# EAGLE design Simple-Charger-LiIon-OpampBased-LM324-Rev (EAGLE 7.2.0)
Simple LM358 OP-AMP based USB Li-ion charger https://www.circuitsdiy.com/simple-lm358-op-amp-based-usb-li-ion-charger/ https://www.circuitsdiy.com/usb-li-ion-charger-revision/
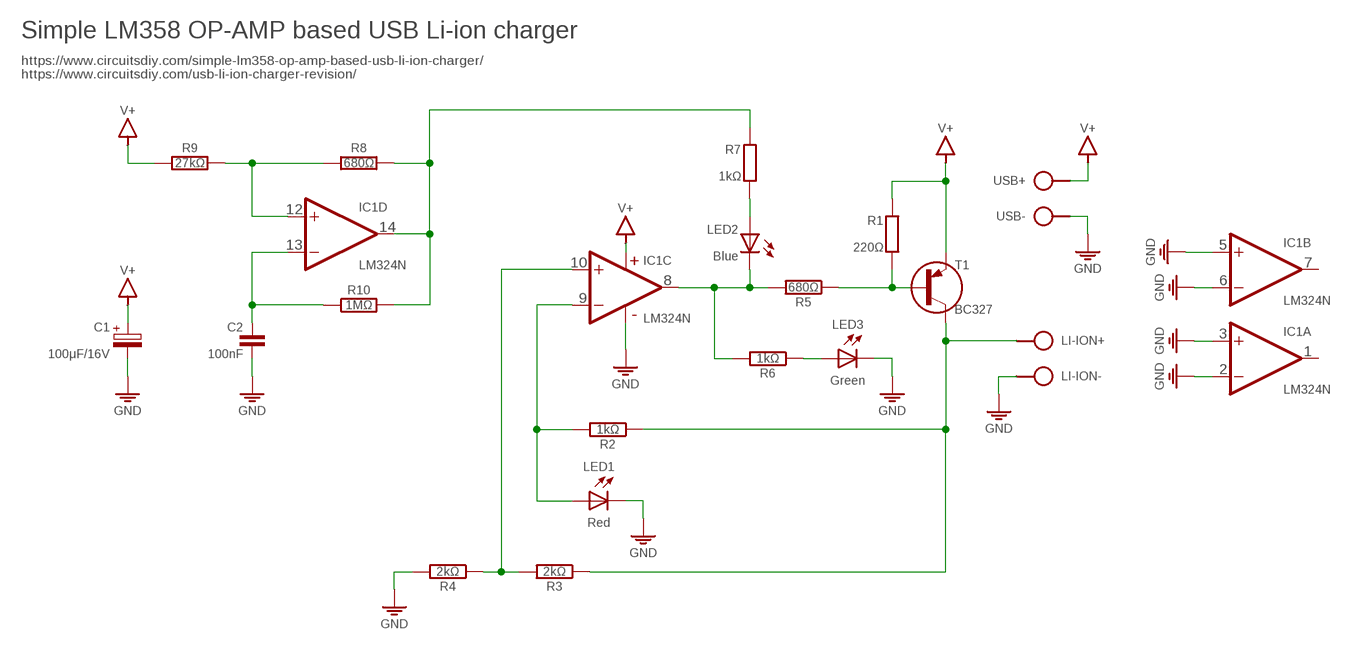
[diagram p0: schematic, sheet 1]

## Parts
C1  100μF/16V  CPOLE2.5-5  [E2,5-5]
C2  100nF  C050-020X044/V  [C050-020X044/V]
IC1  LM324N  [DIL14]
LED1  Red  LED-H-3MM  [LED_3MM]
LED2  Blue  LED-3MM  [LED_3MM]
LED3  Green  LED-H-3MM  [LED_3MM]
LI-ION  SPAD+-+-  [SPAD+-]
R1  220Ω  R0204/10-V  [0204/10-V]
R2  1kΩ  R-H0204/10  [0204/10]
R3  2kΩ  R-H0204/10  [0204/10]
R4  2kΩ  R-H0204/12-V  [0204/12-V]
R5  680Ω  R-H0204/10  [0204/10]
R6  1kΩ  R-H0204/10  [0204/10]
R7  1kΩ  R0204/10  [0204/10]
R8  680Ω  R-H0204/10  [0204/10]
R9  27kΩ  R-H0204/10  [0204/10]
R10  1MΩ  R-H0204/2.54  [0204/2.54]
T1  BC327  [TO92]
USB  SPAD+--+  [SPAD-+]

## Nets
GND: C1.- C2.2 IC1.2(A:-IN) IC1.3(A:+IN) IC1.5(B:+IN) IC1.6(B:-IN) IC1.11(P:V-) LED1.K LED3.K LI-ION.1 R4.2 USB.1
N$1: IC1.12(D:+IN) R8.2 R9.2
N$2: LED2.A R7.2
N$3: C2.1 IC1.13(D:-IN) R10.1
N$4: IC1.14(D:OUT) R7.1 R8.1 R10.2
N$5: IC1.9(C:-IN) LED1.A R2.2
N$7: IC1.8(C:OUT) LED2.K R5.2 R6.2
N$8: R1.2 R5.1 T1.2(B)
N$10: LI-ION.2 R2.1 R3.1 T1.1(C)
N$11: LED3.A R6.1
N$13: IC1.10(C:+IN) R3.2 R4.1
V+: C1.+ IC1.4(P:V+) R1.1 R9.1 T1.3(E) USB.2
Unconnected: IC1.1(A:OUT) IC1.7(B:OUT)

## Notes on the sheet
- Simple LM358 OP-AMP based USB Li-ion charger
- https://www.circuitsdiy.com/simple-lm358-op-amp-based-usb-li-ion-charger/
  https://www.circuitsdiy.com/usb-li-ion-charger-revision/

## Library data of the parts
C1 = c:CPOL: POLARIZED CAPACITOR, European symbol
C2 = c:C: CAPACITOR, European symbol
IC1 = ic:LM324: Single Supply Quad Operational Amplifiers http://www.ti.com/lit/ds/symlink/lm324.pdf
LED1 LED3 = d:LED-H
LED2 = d:LED
LI-ION USB = pad:SPAD+-
R1 R7 = r:R: RESISTOR, European symbol
R2-R6 R8-R10 = r:R-H
T1 = t:BC327

## Board
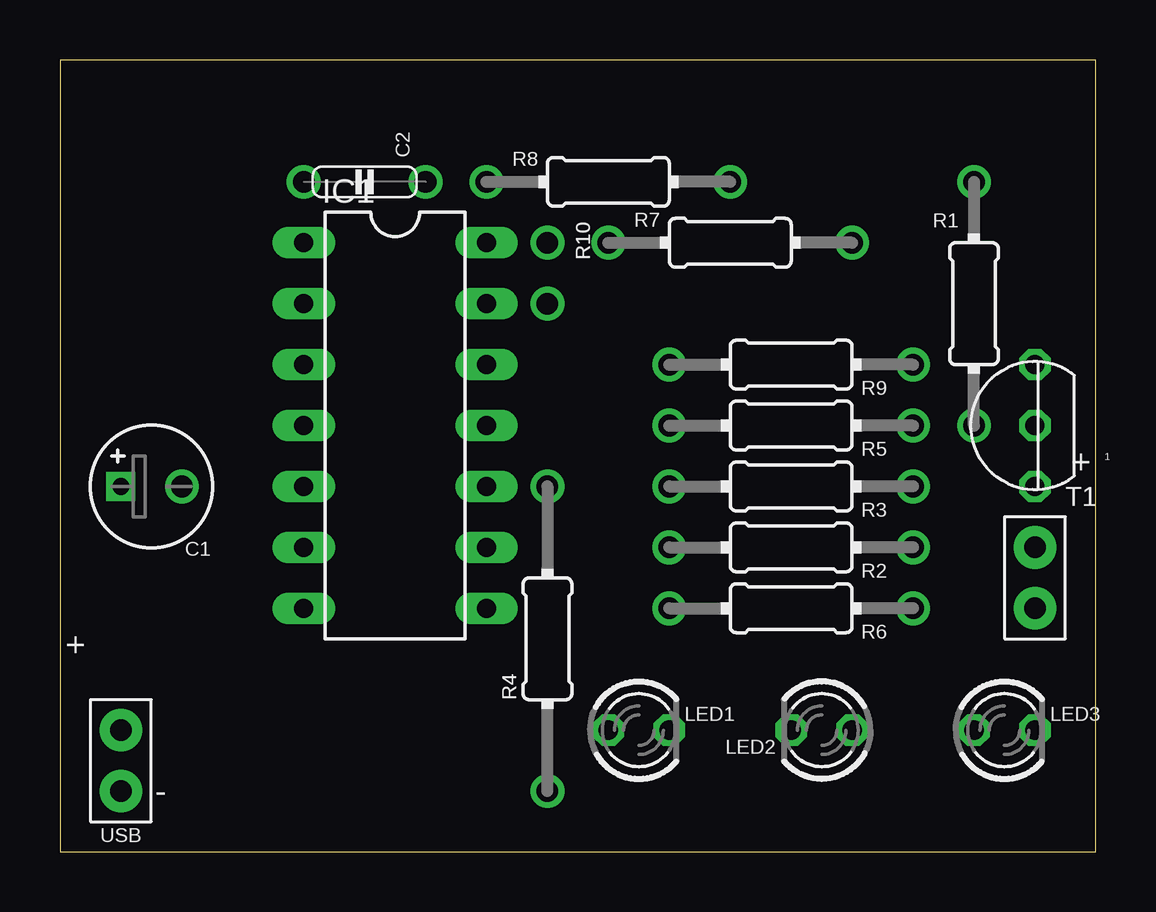
[diagram p1: board, top side]
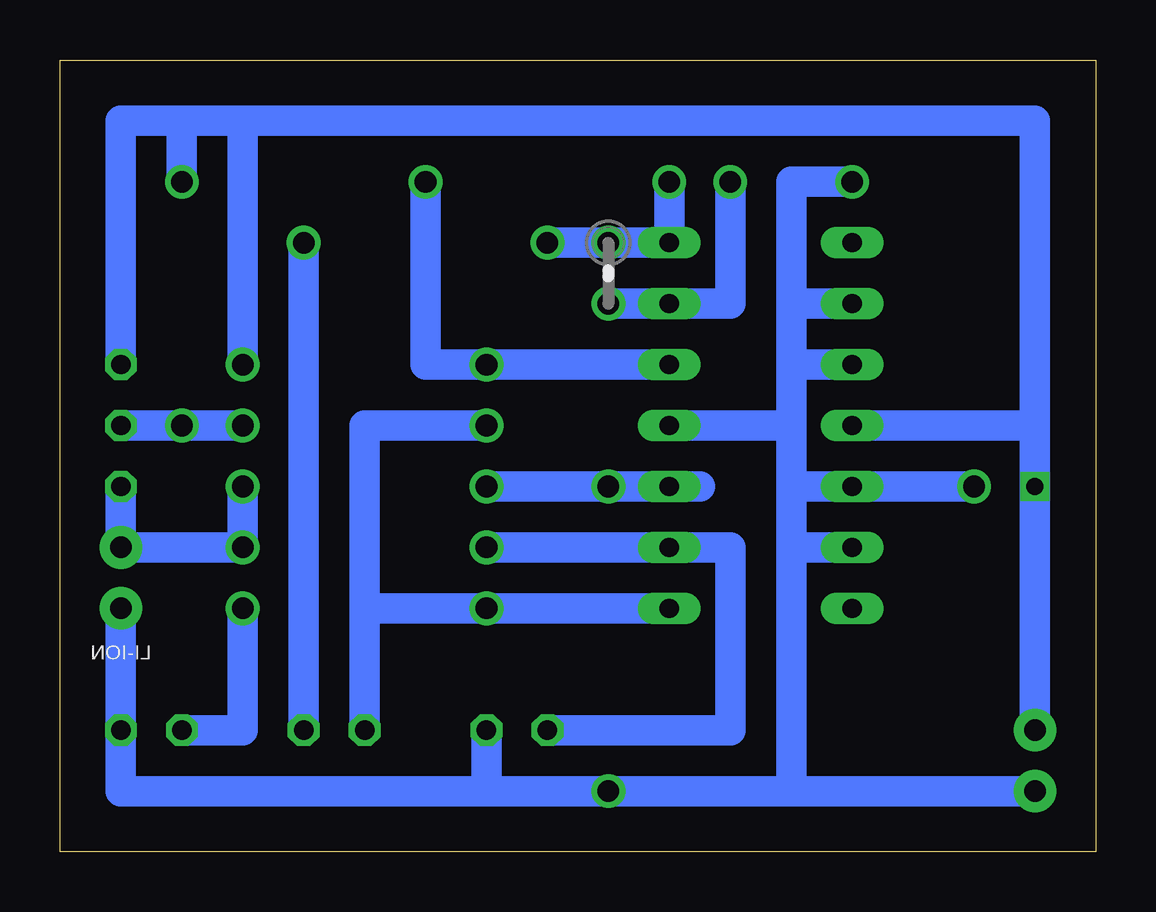
[diagram p2: board, bottom side, seen from below]

Size 43.18 x 33.02 mm. Coordinates in mm from the lower left corner, seen from the top.
Outline: 0,0 43.18,0 43.18,33.02 0,33.02 0,0
Copper layers (1*16): Top 0.035mm / dielectric 1.5mm / Bottom 0.035mm
Design rules "default": minimum track width 10mil, minimum drill 24mil, track to track 8mil, track to pad 8mil, pad to pad 8mil, via to via 8mil, smd to smd 8mil, copper to edge 40mil, drill to drill 8mil, minimum pad ring 10mil, minimum via ring 8mil, stop-mask expansion 4mil, vias tented up to drill 0mil, thermal gap 10mil

### Footprints (pad centres in the part's own frame; a part is rotated, then mirrored left to right if it is on the bottom)
E2,5-5 = drill 0.7 square: + 1.27,0 | drill 0.9: - -1.27,0
C050-020X044/V = drill 0.9: 1 0,2.54; 2 0,-2.54
DIL14 = drill 0.8 long: 1 -3.81,7.62; 2 -3.81,5.08; 3 -3.81,2.54; 4 -3.81,0; 5 -3.81,-2.54; 6 -3.81,-5.08; 7 -3.81,-7.62; 8 3.81,-7.62; 9 3.81,-5.08; 10 3.81,-2.54; 11 3.81,0; 12 3.81,2.54; 13 3.81,5.08; 14 3.81,7.62
LED_3MM = drill 0.813 octagon: A -1.27,0; K 1.27,0
SPAD+- = drill 0.9 pad 1.778: 1 0,-1.27; 2 0,1.27
0204/10-V = drill 0.9: 1 0,5.08; 2 0,-5.08
0204/10 = drill 0.9: 1 -5.08,0; 2 5.08,0
0204/12-V = drill 0.9: 1 0,6.35; 2 0,-6.35
0204/2.54 = drill 0.9: 1 1.27,0; 2 -1.27,0
TO92 = drill 0.8 octagon: 1 0,2.54; 2 0,0; 3 0,-2.54
SPAD-+ = drill 0.9 pad 1.778: 1 0,-1.27; 2 0,1.27

### Placement (x,y rotation side)
C1  3.81,15.24 180 top
C2  12.7,27.94 270 top
IC1  13.97,17.78 0 top
LED1  24.13,5.08 0 top
LED2  31.75,5.08 180 top
LED3  39.37,5.08 0 top
LI-ION  40.64,11.43 0 top
R1  38.1,22.86 0 top
R2  30.48,12.7 180 top
R3  30.48,15.24 180 top
R4  20.32,8.89 0 top
R5  30.48,17.78 180 top
R6  30.48,10.16 180 top
R7  27.94,25.4 0 top
R8  22.86,27.94 0 top
R9  30.48,20.32 180 top
R10  20.32,24.13 270 top
T1  40.64,17.78 180 top
USB  2.54,3.81 0 top

### Tracks (layer width: path | path; a pad name or v marks a point on that pad's centre or on a via)
GND
  Bottom 1.27: R4.2 40.64,2.54 LED3.K LI-ION.1 | 12.7,20.32 12.7,22.86 | 12.7,15.24 IC1.5 C1.- | C2.2 12.7,27.94 12.7,22.86 | 12.7,22.86 IC1.2 | 12.7,15.24 12.7,12.7 | USB.1 12.7,2.54 | IC1.3 12.7,20.32 | 12.7,20.32 12.7,17.78 | 12.7,15.24 12.7,17.78 | 12.7,17.78 IC1.11 | IC1.6 12.7,12.7 | 12.7,12.7 12.7,2.54 | 12.7,2.54 R4.2 | R4.2 25.4,2.54 LED1.K
N$1
  Bottom 1.27: IC1.12 R9.2 27.94,20.32 R8.2
N$2
  Bottom 1.27: LED2.A R7.2
N$3
  Bottom 1.27: 15.24,25.4 C2.1 15.24,22.86 IC1.13 R10.1
N$4
  Bottom 1.27: R7.1 R10.2 IC1.14 R8.1
N$5
  Bottom 1.27: R2.2 IC1.9 15.24,12.7 15.24,5.08 LED1.A
N$7
  Bottom 1.27: IC1.8 R6.2 30.48,10.16 | LED2.K 30.48,10.16 | R5.2 30.48,17.78 30.48,10.16
N$8
  Bottom 1.27: T1.2 R1.2 R5.1
N$10
  Bottom 1.27: T1.1 LI-ION.2 R2.1 R3.1
N$11
  Bottom 1.27: LED3.A 35.56,5.08 R6.1
N$13
  Bottom 1.27: 16.51,15.24 IC1.10 | R3.2 IC1.10 | IC1.10 R4.1
V+
  Bottom 1.27: 38.1,30.48 R1.1 38.1,30.48 | 38.1,30.48 40.64,30.48 T1.3 | IC1.4 2.54,17.78 | 2.54,17.78 USB.2 C1.+ | 2.54,17.78 2.54,30.48 35.56,30.48 | 38.1,30.48 35.56,30.48 | R9.1 35.56,30.48